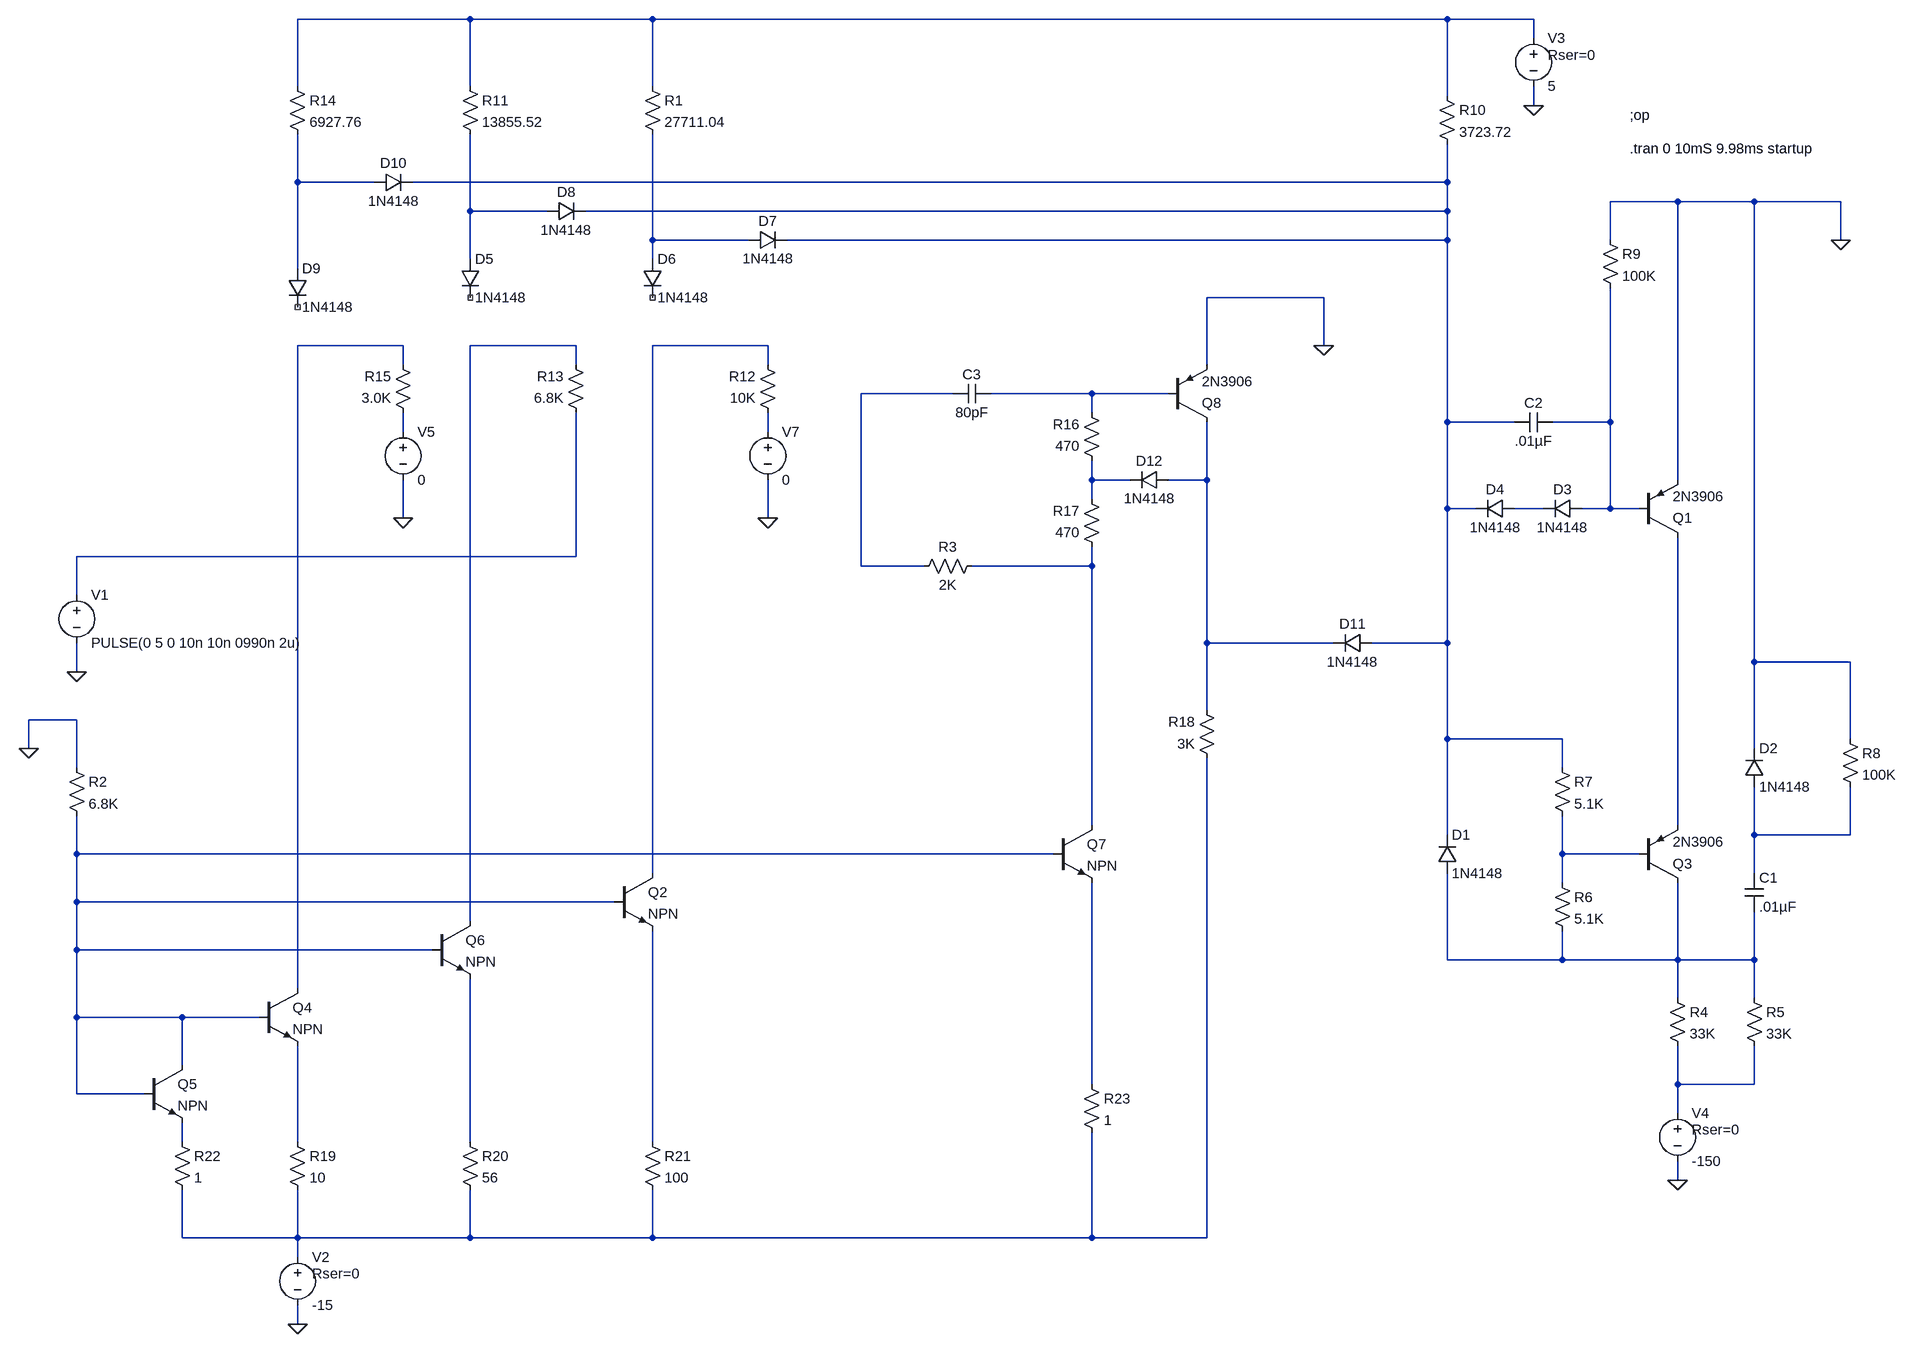
[diagram p0: schematic intensifier.asc]
intensifier.asc, the LTspice schematic file:
Version 4
SHEET 1 1440 1380
WIRE -1424 -816 -1712 -816
WIRE -1120 -816 -1424 -816
WIRE 528 -816 -1120 -816
WIRE 672 -816 528 -816
WIRE 672 -784 672 -816
WIRE -1712 -704 -1712 -816
WIRE -1424 -704 -1424 -816
WIRE -1120 -704 -1120 -816
WIRE 528 -688 528 -816
WIRE 672 -672 672 -704
WIRE -1712 -544 -1712 -624
WIRE -1584 -544 -1712 -544
WIRE 528 -544 528 -608
WIRE 528 -544 -1520 -544
WIRE 912 -512 800 -512
WIRE 1040 -512 912 -512
WIRE 1184 -512 1040 -512
WIRE -1424 -496 -1424 -624
WIRE -1296 -496 -1424 -496
WIRE 528 -496 528 -544
WIRE 528 -496 -1232 -496
WIRE -1120 -448 -1120 -624
WIRE -960 -448 -1120 -448
WIRE 528 -448 528 -496
WIRE 528 -448 -896 -448
WIRE 800 -448 800 -512
WIRE 1184 -448 1184 -512
WIRE -1424 -416 -1424 -496
WIRE -1120 -416 -1120 -448
WIRE -1712 -400 -1712 -544
WIRE 192 -352 -16 -352
WIRE -1536 -272 -1712 -272
WIRE -1248 -272 -1424 -272
WIRE -928 -272 -1120 -272
WIRE 192 -272 192 -352
WIRE -1536 -240 -1536 -272
WIRE -1248 -240 -1248 -272
WIRE -928 -240 -928 -272
WIRE -16 -240 -16 -352
WIRE -448 -192 -656 -192
WIRE -208 -192 -384 -192
WIRE -80 -192 -208 -192
WIRE -208 -160 -208 -192
WIRE 528 -144 528 -448
WIRE 640 -144 528 -144
WIRE 800 -144 800 -368
WIRE 800 -144 704 -144
WIRE -1536 -128 -1536 -160
WIRE -928 -128 -928 -160
WIRE -208 -48 -208 -80
WIRE -144 -48 -208 -48
WIRE -16 -48 -16 -144
WIRE -16 -48 -80 -48
WIRE 912 -48 912 -512
WIRE -208 -16 -208 -48
WIRE 528 0 528 -144
WIRE 576 0 528 0
WIRE 688 0 640 0
WIRE 800 0 800 -144
WIRE 800 0 752 0
WIRE 848 0 800 0
WIRE -1536 16 -1536 -48
WIRE -928 16 -928 -48
WIRE -1248 80 -1248 -160
WIRE -1248 80 -2080 80
WIRE -656 96 -656 -192
WIRE -496 96 -656 96
WIRE -208 96 -208 64
WIRE -208 96 -416 96
WIRE -2080 144 -2080 80
WIRE -16 224 -16 -48
WIRE 208 224 -16 224
WIRE 528 224 528 0
WIRE 528 224 272 224
WIRE 1040 256 1040 -512
WIRE 1200 256 1040 256
WIRE -2080 272 -2080 224
WIRE -16 336 -16 224
WIRE -2080 352 -2160 352
WIRE 528 384 528 224
WIRE 720 384 528 384
WIRE 1200 384 1200 256
WIRE -2160 400 -2160 352
WIRE 1040 400 1040 256
WIRE -2080 432 -2080 352
WIRE 720 432 720 384
WIRE -208 528 -208 96
WIRE 912 528 912 48
WIRE 528 544 528 384
WIRE 1040 544 1040 464
WIRE 1200 544 1200 464
WIRE 1200 544 1040 544
WIRE -2080 576 -2080 512
WIRE -272 576 -2080 576
WIRE 720 576 720 512
WIRE 848 576 720 576
WIRE -1120 608 -1120 -272
WIRE 1040 608 1040 544
WIRE 720 624 720 576
WIRE -2080 656 -2080 576
WIRE -1184 656 -2080 656
WIRE -1424 688 -1424 -272
WIRE -2080 736 -2080 656
WIRE -1488 736 -2080 736
WIRE 528 752 528 608
WIRE 720 752 720 704
WIRE 720 752 528 752
WIRE 912 752 912 624
WIRE 912 752 720 752
WIRE 1040 752 1040 672
WIRE 1040 752 912 752
WIRE -1712 800 -1712 -272
WIRE 912 816 912 752
WIRE 1040 816 1040 752
WIRE -2080 848 -2080 736
WIRE -1904 848 -2080 848
WIRE -1776 848 -1904 848
WIRE -1904 928 -1904 848
WIRE -208 960 -208 624
WIRE 912 960 912 896
WIRE 1040 960 1040 896
WIRE 1040 960 912 960
WIRE -2080 976 -2080 848
WIRE -1968 976 -2080 976
WIRE 912 1008 912 960
WIRE -1904 1056 -1904 1024
WIRE -1712 1056 -1712 896
WIRE -1424 1056 -1424 784
WIRE -1120 1056 -1120 704
WIRE 912 1120 912 1088
WIRE -1904 1216 -1904 1136
WIRE -1712 1216 -1712 1136
WIRE -1712 1216 -1904 1216
WIRE -1424 1216 -1424 1136
WIRE -1424 1216 -1712 1216
WIRE -1120 1216 -1120 1136
WIRE -1120 1216 -1424 1216
WIRE -208 1216 -208 1040
WIRE -208 1216 -1120 1216
WIRE -16 1216 -16 416
WIRE -16 1216 -208 1216
WIRE -1712 1248 -1712 1216
WIRE -1712 1360 -1712 1328
FLAG 672 -672 0
FLAG 912 1120 0
FLAG 1184 -448 0
FLAG -1712 1360 0
FLAG -2160 400 0
FLAG -1536 16 0
FLAG -928 16 0
FLAG 192 -272 0
FLAG -2080 272 0
SYMBOL pnp 848 48 M180
SYMATTR InstName Q1
SYMATTR Value 2N3906
SYMBOL pnp 848 624 M180
SYMATTR InstName Q3
SYMATTR Value 2N3906
SYMBOL diode 512 608 M180
WINDOW 0 24 64 Left 2
WINDOW 3 24 0 Left 2
SYMATTR InstName D1
SYMATTR Value 1N4148
SYMBOL res 896 800 R0
SYMATTR InstName R4
SYMATTR Value 33K
SYMBOL res 1024 800 R0
SYMATTR InstName R5
SYMATTR Value 33K
SYMBOL res 704 608 R0
SYMATTR InstName R6
SYMATTR Value 5.1K
SYMBOL res 704 416 R0
SYMATTR InstName R7
SYMATTR Value 5.1K
SYMBOL cap 1024 608 R0
SYMATTR InstName C1
SYMATTR Value .01µF
SYMBOL res 1184 368 R0
SYMATTR InstName R8
SYMATTR Value 100K
SYMBOL diode 1024 464 M180
WINDOW 0 24 64 Left 2
WINDOW 3 24 0 Left 2
SYMATTR InstName D2
SYMATTR Value 1N4148
SYMBOL diode 752 -16 R90
WINDOW 0 0 32 VBottom 2
WINDOW 3 32 32 VTop 2
SYMATTR InstName D3
SYMATTR Value 1N4148
SYMBOL diode 640 -16 R90
WINDOW 0 0 32 VBottom 2
WINDOW 3 32 32 VTop 2
SYMATTR InstName D4
SYMATTR Value 1N4148
SYMBOL cap 704 -160 R90
WINDOW 0 0 32 VBottom 2
WINDOW 3 32 32 VTop 2
SYMATTR InstName C2
SYMATTR Value .01µF
SYMBOL res 784 -464 R0
SYMATTR InstName R9
SYMATTR Value 100K
SYMBOL res 512 -704 R0
SYMATTR InstName R10
SYMATTR Value 3723.72
SYMBOL voltage 672 -800 R0
WINDOW 123 0 0 Left 2
WINDOW 39 24 44 Left 2
SYMATTR InstName V3
SYMATTR Value 5
SYMATTR SpiceLine Rser=0
SYMBOL voltage 912 992 R0
WINDOW 123 0 0 Left 2
WINDOW 39 24 44 Left 2
SYMATTR InstName V4
SYMATTR Value -150
SYMATTR SpiceLine Rser=0
SYMBOL res -1136 -720 R0
SYMATTR InstName R1
SYMATTR Value 27711.04
SYMBOL npn -1776 800 R0
SYMATTR InstName Q4
SYMBOL npn -1968 928 R0
SYMATTR InstName Q5
SYMBOL voltage -1712 1232 R0
WINDOW 123 0 0 Left 2
WINDOW 39 24 44 Left 2
SYMATTR InstName V2
SYMATTR Value -15
SYMATTR SpiceLine Rser=0
SYMBOL res -2096 416 R0
SYMATTR InstName R2
SYMATTR Value 6.8K
SYMBOL diode -1136 -416 R0
SYMATTR InstName D6
SYMATTR Value 1N4148
SYMBOL res -912 -144 R180
WINDOW 0 36 76 Left 2
WINDOW 3 36 40 Left 2
SYMATTR InstName R12
SYMATTR Value 10K
SYMBOL diode -960 -432 R270
WINDOW 0 32 32 VTop 2
WINDOW 3 0 32 VBottom 2
SYMATTR InstName D7
SYMATTR Value 1N4148
SYMBOL npn -1184 608 R0
SYMATTR InstName Q2
SYMBOL res -1440 -720 R0
SYMATTR InstName R11
SYMATTR Value 13855.52
SYMBOL diode -1440 -416 R0
SYMATTR InstName D5
SYMATTR Value 1N4148
SYMBOL voltage -1536 -144 R0
WINDOW 123 0 0 Left 2
WINDOW 39 0 0 Left 2
SYMATTR InstName V5
SYMATTR Value 0
SYMBOL res -1232 -144 R180
WINDOW 0 36 76 Left 2
WINDOW 3 36 40 Left 2
SYMATTR InstName R13
SYMATTR Value 6.8K
SYMBOL diode -1296 -480 R270
WINDOW 0 32 32 VTop 2
WINDOW 3 0 32 VBottom 2
SYMATTR InstName D8
SYMATTR Value 1N4148
SYMBOL res -1728 -720 R0
SYMATTR InstName R14
SYMATTR Value 6927.76
SYMBOL diode -1728 -400 R0
SYMATTR InstName D9
SYMATTR Value 1N4148
SYMBOL voltage -928 -144 R0
WINDOW 123 0 0 Left 2
WINDOW 39 0 0 Left 2
SYMATTR InstName V7
SYMATTR Value 0
SYMBOL res -1520 -144 R180
WINDOW 0 36 76 Left 2
WINDOW 3 36 40 Left 2
SYMATTR InstName R15
SYMATTR Value 3.0K
SYMBOL diode -1584 -528 R270
WINDOW 0 32 32 VTop 2
WINDOW 3 0 32 VBottom 2
SYMATTR InstName D10
SYMATTR Value 1N4148
SYMBOL npn -1488 688 R0
SYMATTR InstName Q6
SYMBOL voltage -2080 128 R0
WINDOW 123 0 0 Left 2
WINDOW 39 0 0 Left 2
SYMATTR InstName V1
SYMATTR Value PULSE(0 5 0 10n 10n 0990n 2u)
SYMBOL cap -384 -208 R90
WINDOW 0 0 32 VBottom 2
WINDOW 3 32 32 VTop 2
SYMATTR InstName C3
SYMATTR Value 80pF
SYMBOL res -512 112 R270
WINDOW 0 32 56 VTop 2
WINDOW 3 0 56 VBottom 2
SYMATTR InstName R3
SYMATTR Value 2K
SYMBOL res -192 -64 R180
WINDOW 0 36 76 Left 2
WINDOW 3 36 40 Left 2
SYMATTR InstName R16
SYMATTR Value 470
SYMBOL res -192 80 R180
WINDOW 0 36 76 Left 2
WINDOW 3 36 40 Left 2
SYMATTR InstName R17
SYMATTR Value 470
SYMBOL npn -272 528 R0
SYMATTR InstName Q7
SYMBOL pnp -80 -144 M180
SYMATTR InstName Q8
SYMATTR Value 2N3906
SYMBOL diode 272 208 R90
WINDOW 0 0 32 VBottom 2
WINDOW 3 32 32 VTop 2
SYMATTR InstName D11
SYMATTR Value 1N4148
SYMBOL diode -80 -64 R90
WINDOW 0 0 32 VBottom 2
WINDOW 3 32 32 VTop 2
SYMATTR InstName D12
SYMATTR Value 1N4148
SYMBOL res 0 432 R180
WINDOW 0 36 76 Left 2
WINDOW 3 36 40 Left 2
SYMATTR InstName R18
SYMATTR Value 3K
SYMBOL res -1728 1040 R0
SYMATTR InstName R19
SYMATTR Value 10
SYMBOL res -1440 1040 R0
SYMATTR InstName R20
SYMATTR Value 56
SYMBOL res -1136 1040 R0
SYMATTR InstName R21
SYMATTR Value 100
SYMBOL res -1920 1040 R0
SYMATTR InstName R22
SYMATTR Value 1
SYMBOL res -224 944 R0
SYMATTR InstName R23
SYMATTR Value 1
TEXT 832 -656 Left 2 !;op
TEXT 832 -600 Left 2 !.tran 0 10mS 9.98ms startup

The netlist it stands for:
* intensifier.asc
Q1 N019 N011 0 0 2N3906
Q3 N023 N022 N019 0 2N3906
D1 N023 N003 1N4148
R4 N023 N025 33K
R5 N023 N025 33K
R6 N022 N023 5.1K
R7 N003 N022 5.1K
C1 N020 N023 .01µF
R8 0 N020 100K
D2 N020 0 1N4148
D3 N011 N016 1N4148
D4 N016 N003 1N4148
C2 N011 N003 .01µF
R9 0 N011 100K
R10 N001 N003 3723.72
V3 N001 0 5 Rser=0
V4 N025 0 -150 Rser=0
R1 N001 N005 27711.04
Q4 N006 N021 N027 0 NPN
Q5 N021 N021 N026 0 NPN
V2 N030 0 -15 Rser=0
R2 0 N021 6.8K
D6 N005 NC_01 1N4148
R12 N013 N008 10K
D7 N005 N003 1N4148
Q2 N008 N021 N029 0 NPN
R11 N001 N004 13855.52
D5 N004 NC_02 1N4148
V5 N012 0 0
R13 N017 N007 6.8K
D8 N004 N003 1N4148
R14 N001 N002 6927.76
D9 N002 NC_03 1N4148
V7 N013 0 0
R15 N012 N006 3.0K
D10 N002 N003 1N4148
Q6 N007 N021 N028 0 NPN
V1 N017 0 PULSE(0 5 0 10n 10n 0990n 2u)
C3 N010 N009 80pF
R3 N009 N018 2K
R16 N014 N010 470
R17 N018 N014 470
Q7 N018 N021 N024 0 NPN
Q8 N015 N010 0 0 2N3906
D11 N003 N015 1N4148
D12 N015 N014 1N4148
R18 N030 N015 3K
R19 N027 N030 10
R20 N028 N030 56
R21 N029 N030 100
R22 N026 N030 1
R23 N024 N030 1
.model D D
.lib standard.dio
.model NPN NPN
.model PNP PNP
.lib standard.bjt
;op
.tran 0 10mS 9.98ms startup
.backanno
.end